# EAGLE design Pololu Magnetic Encoder Base (EAGLE 6.1)
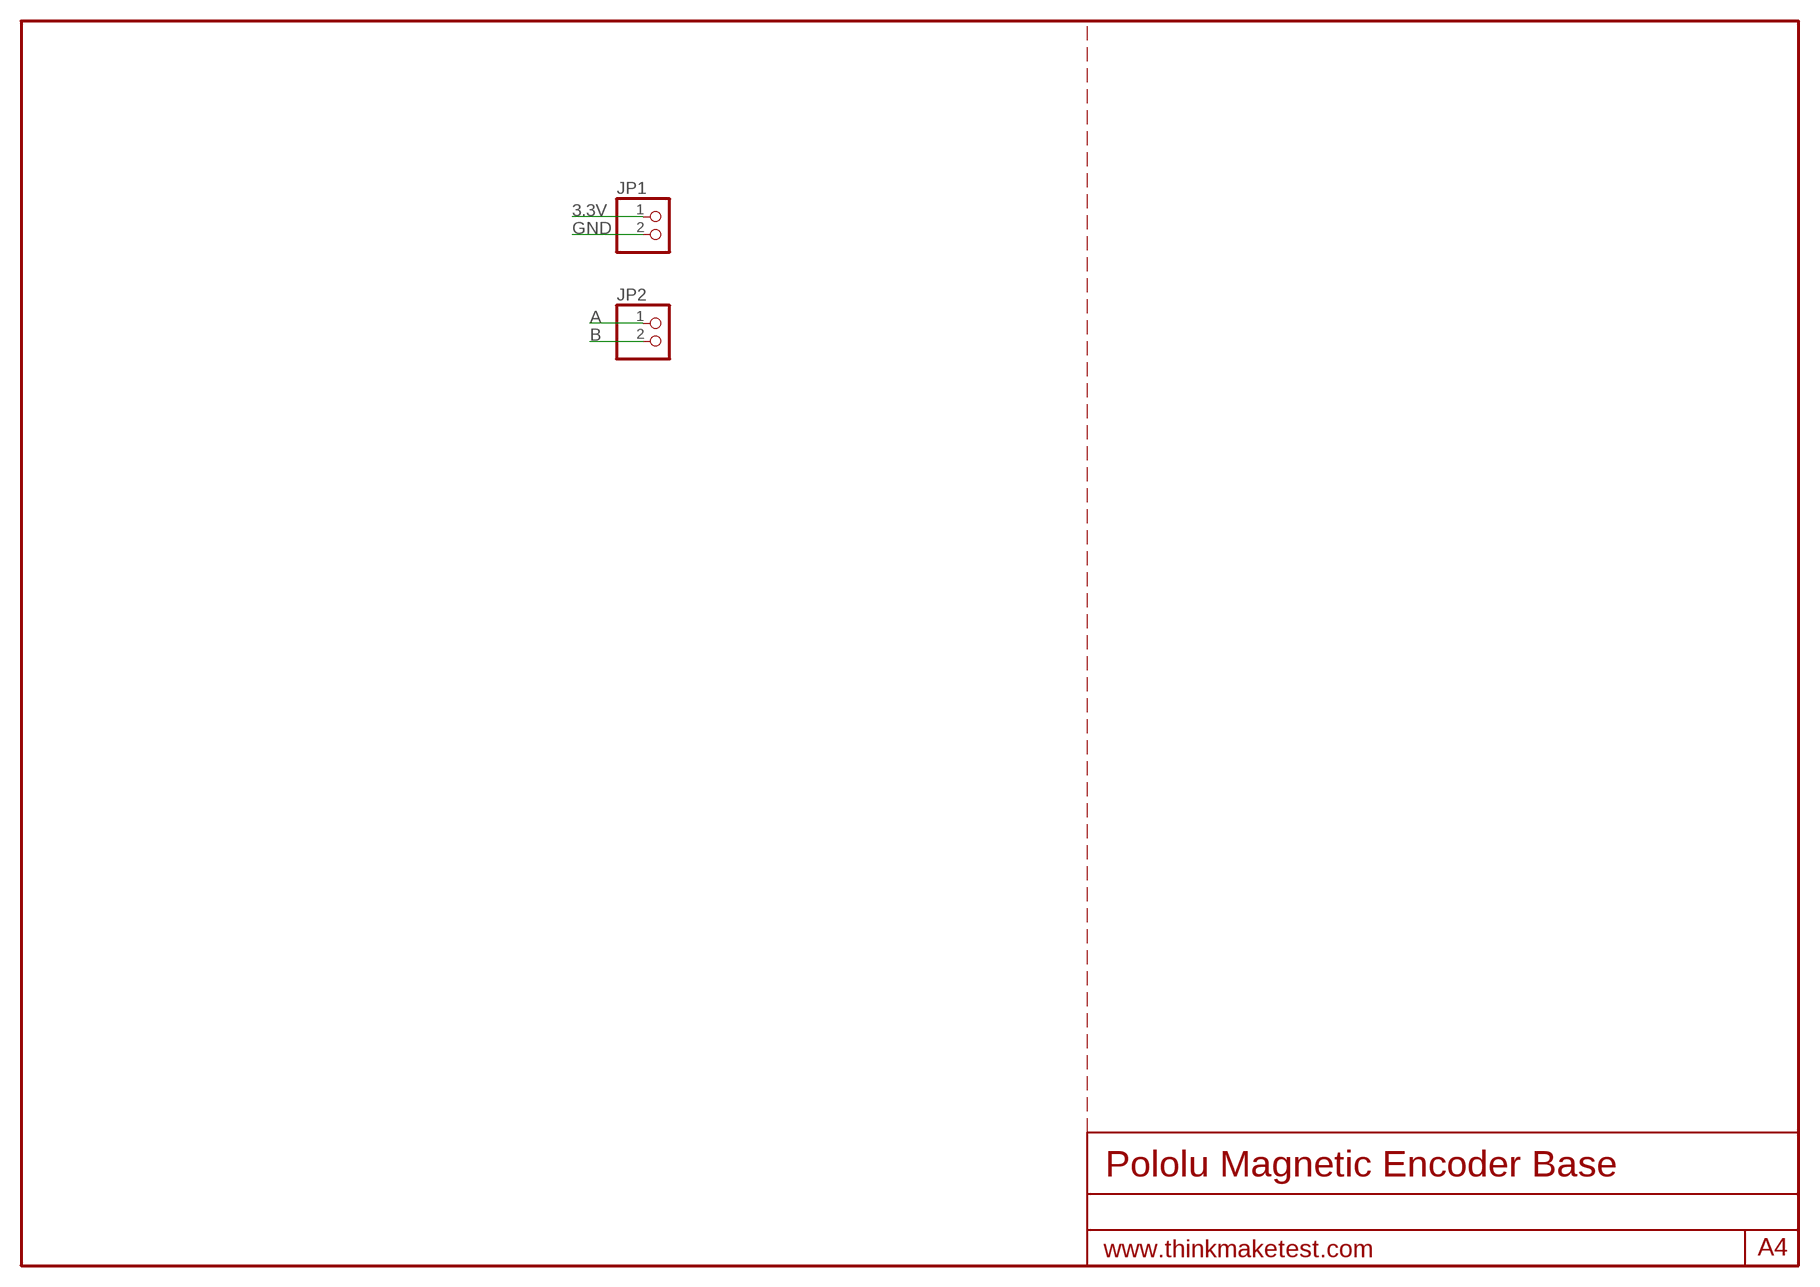
[diagram p0: schematic, sheet 1]

## Parts
JP1  HEADER-1X2ROUND  [1X02_ROUND]
JP2  HEADER-1X2ROUND  [1X02_ROUND]

## Nets
3.3V: JP1.1
A: JP2.1
B: JP2.2
GND: JP1.2

## Library data of the parts
JP1 JP2 = microbuilder:HEADER-1X2: PIN HEADER

## Board
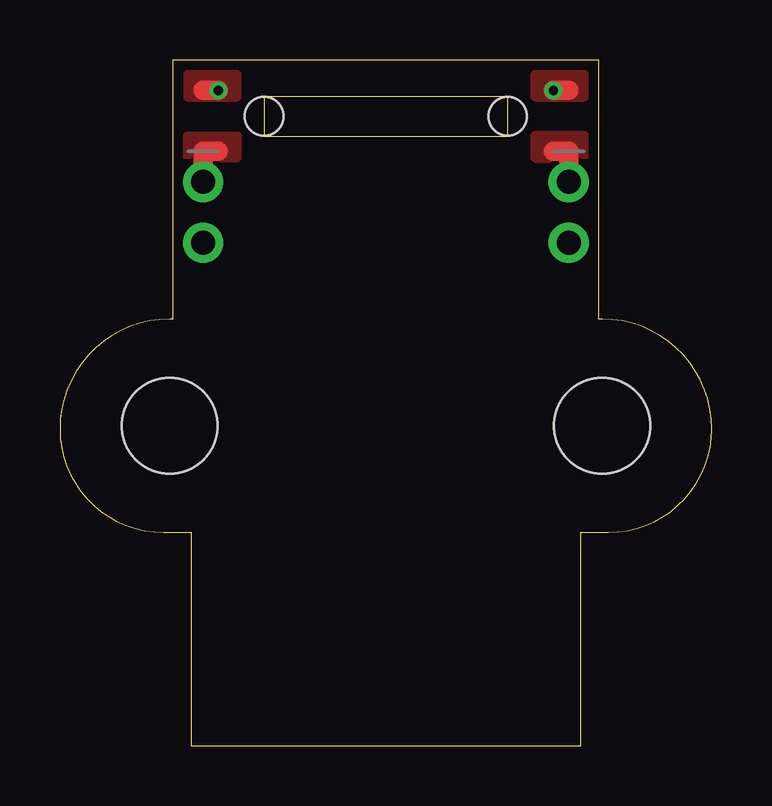
[diagram p1: board, top side]
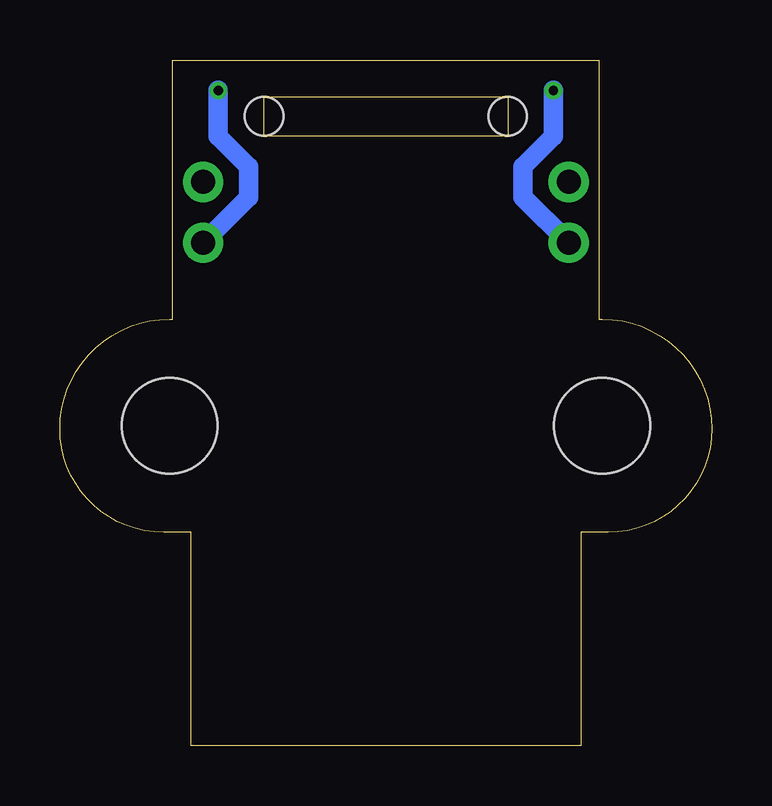
[diagram p2: board, bottom side, seen from below]

Size 27.18 x 28.57 mm. Coordinates in mm from the lower left corner, seen from the top.
Outline: 5.46,0 21.72,0 21.72,8.89 22.86,8.89 arc90 27.18,13.21 arc90 22.61,17.78 22.48,17.78 22.48,28.57 4.7,28.57 4.7,17.78 4.57,17.78 arc90 0,13.21 arc90 4.32,8.89 5.46,8.89 5.46,0
Outline: 8.51,25.4 18.67,25.4 18.67,27.05 8.51,27.05 8.51,25.4
Copper layers (1*16): Top 0.0356mm / dielectric 1.5011mm / Bottom 0.0356mm
Design rules: minimum track width 6mil, minimum drill 13mil, track to track 6mil, track to pad 6mil, pad to pad 6mil, via to via 6mil, smd to smd 6mil, copper to edge 15mil, drill to drill 6mil, minimum pad ring 7mil, minimum via ring 7mil, stop-mask expansion 4mil, vias tented up to drill 16mil, thermal gap 10mil
Holes 4 mm at 4.57,13.34 22.61,13.34
Holes 1.6 mm at 8.51,26.23 18.67,26.23

### Footprints (pad centres in the part's own frame; a part is rotated, then mirrored left to right if it is on the bottom)
1X02_ROUND = drill 1 pad 1.676: 1 -1.27,0; 2 1.27,0

### Placement (x,y rotation side)
JP1  5.97,22.23 270 top
JP2  21.21,22.23 270 top

### Tracks (layer width: path | path; a pad name or v marks a point on that pad's centre or on a via)
3.3V
  Top 0.813: JP1.1 5.97,24.77 6.6,24.77
  pour Top: 5.33,25.4 7.37,25.4 7.37,24.51 5.33,24.51
A
  Top 0.813: JP2.1 21.21,24.77 20.57,24.77
  pour Top: 21.84,25.4 19.81,25.4 19.81,24.51 21.84,24.51
B  (via drill 0.38)
  Top 0.813: v20.57,27.3 21.21,27.3
  Bottom 0.813: JP2.2 19.3,22.86 19.3,24.13 20.57,25.4 v20.57,27.3
  pour Top: 21.84,27.94 19.81,27.94 19.81,27.05 21.84,27.05
GND  (via drill 0.38)
  Top 0.813: v6.6,27.3 5.97,27.3
  Bottom 0.813: JP1.2 7.87,22.86 7.87,24.13 6.6,25.4 v6.6,27.3
  pour Top: 7.37,27.05 7.37,27.94 5.33,27.94 5.33,27.05

### Text on the board
tDocu: 3.3v | A | GND | B
bDocu: 3.3v | A | GND | B